# Altium schematic sheet Encoders.SchDoc
size A4; SheetNumber: 5; SheetTotal: 6
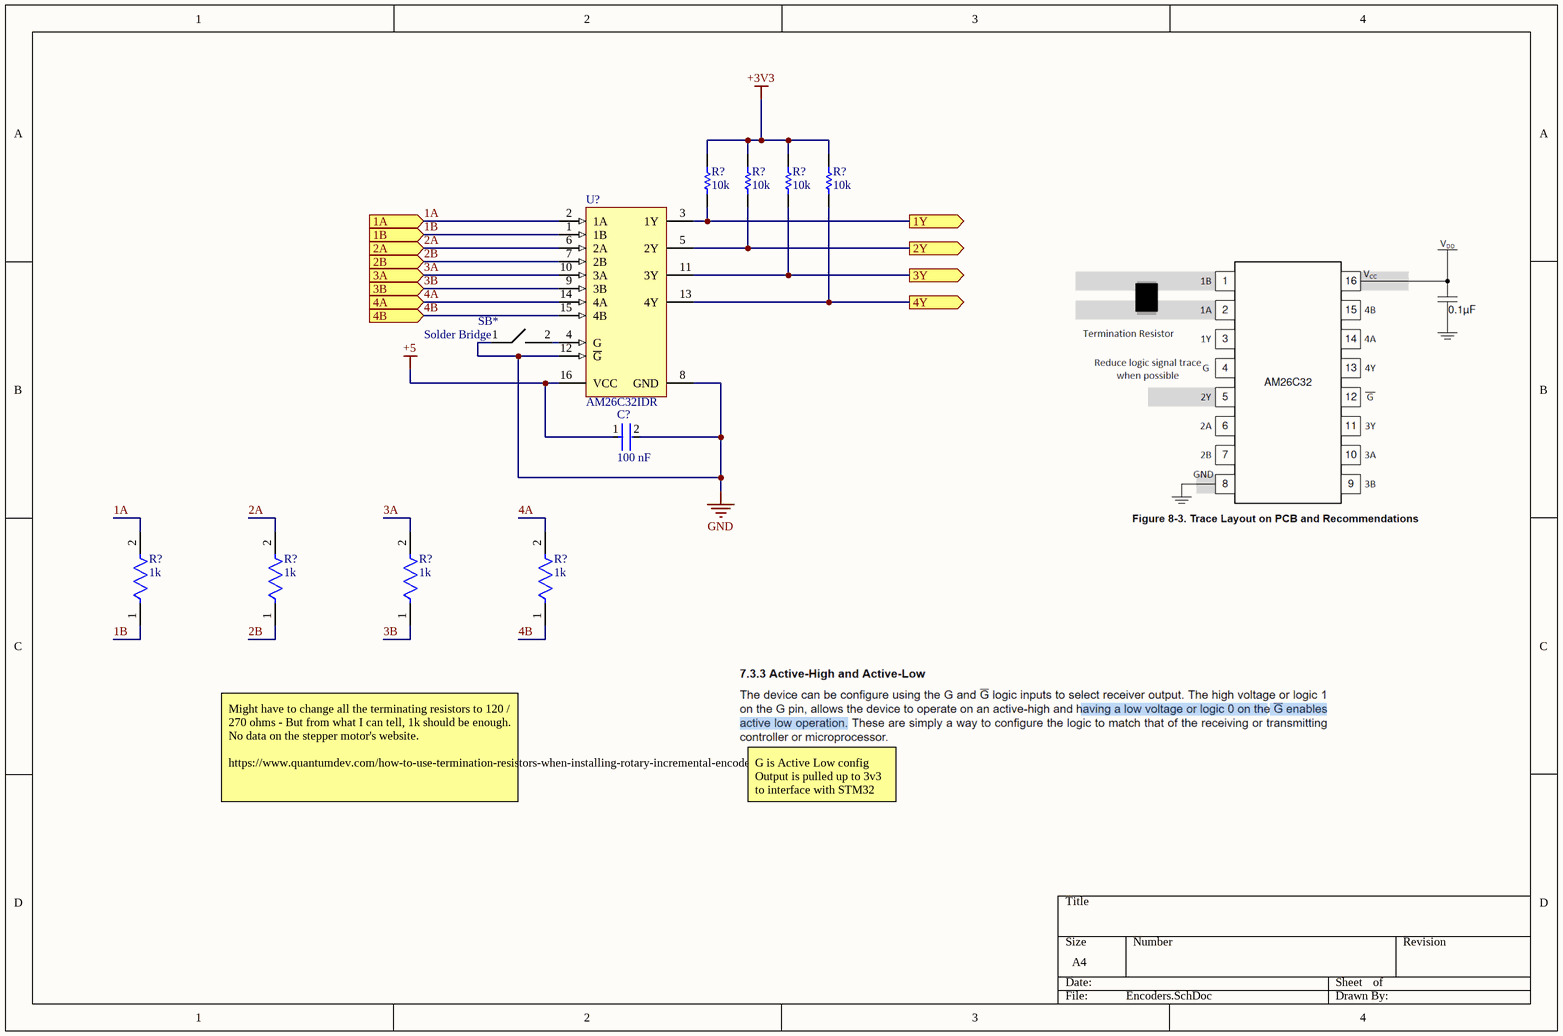
[diagram p0: Encoders.SchDoc]

## Parts
(Parts that share a designator on the sheet are numbered #1, #2 ... from top to bottom, then left to right.)
C?  Capacitance: 100 nF  [FP-CC0603-DA-MFG]  (hidden comment: CC0603KRX7R9BB104)
R?#1  Resistance: 10k  [RESC1609X50X30NL8T20]  (hidden comment: 0603WAF1002T5E)
R?#2  Resistance: 10k  [RESC1609X50X30NL8T20]  (hidden comment: 0603WAF1002T5E)
R?#3  Resistance: 10k  [RESC1609X50X30NL8T20]  (hidden comment: 0603WAF1002T5E)
R?#4  Resistance: 10k  [RESC1609X50X30NL8T20]  (hidden comment: 0603WAF1002T5E)
R?#5  1k  [FP-RC0603-0_55-IPC_C]
R?#6  1k  [FP-RC0603-0_55-IPC_C]
R?#7  1k  [FP-RC0603-0_55-IPC_C]
R?#8  1k  [FP-RC0603-0_55-IPC_C]
SB*  Solder Bridge  [Solder Bridge-Footprint-1]
U?  AM26C32IDR  [D0016A_L]

## Ports
1A (in), 1B (in), 1Y (out), 2A (in), 2B (in), 2Y (out), 3A (in), 3B (in), 3Y (out), 4A (in), 4B (in), 4Y (out)

## Nets
+3V3: R?#1.2 R?#2.2 R?#3.2 R?#4.2
+5: C?.1 U?.16(VCC)
GND: C?.2 SB*.1 U?.8(GND) U?.12(~{G})
1A: R?#5.2 U?.2(1A) ; port 1A
1B: R?#5.1 U?.1(1B) ; port 1B
1Y: R?#1.1 U?.3(1Y) ; port 1Y
2A: R?#6.2 U?.6(2A) ; port 2A
2B: R?#6.1 U?.7(2B) ; port 2B
2Y: R?#2.1 U?.5(2Y) ; port 2Y
3A: R?#7.2 U?.10(3A) ; port 3A
3B: R?#7.1 U?.9(3B) ; port 3B
3Y: R?#3.1 U?.11(3Y) ; port 3Y
4A: R?#8.2 U?.14(4A) ; port 4A
4B: R?#8.1 U?.15(4B) ; port 4B
4Y: R?#4.1 U?.13(4Y) ; port 4Y
NetSB*_2: SB*.2 U?.4(G)

## Notes on the sheet
- Might have to change all the terminating resistors to 120 / 270 ohms - But from what I can tell, 1k should be enough. No data on the stepper motor's website.
  https://www.quantumdev.com/how-to-use-termination-resistors-when-installing-rotary-incremental-encoders/
- G is Active Low config
  Output is pulled up to 3v3 to interface with STM32

## Library data of the parts
C? = CMP-2100-03601-2: CAP CER 0.1UF 50V X7R 0603; Manufacturer: YAGEO; Material: Ceramic; Temperature Coefficient: 15%; Tolerance: 0.1; Value: 100 nF; Height: 0.9mm; Voltage: 50 V; ComponentLink2Description: Datasheet; Device Class L2: Capacitors; Temperature Range High: +125°C; Category: Cap; Footprint Url: http://www.yageo.com/exep/pages/download/literatures/UPY-C_GEN_24.pdf; ComponentLink2URL: http://www.yageo.com/documents/recent/UPY-GPHC_X7R_6.3V-to-50V_18.pdf; Package: CC0603-DA; Temperature: -55°C to +125°C; Voltage Rating: 50 V; Temperature Characteristic: X7R; Device Class L1: Passive Components; Temperature Range Low: -55°C; Manufacturer Part Number: CC0603KRX7R9BB104; RoHS: TRUE; Automotive: No; Device Class L3: Ceramic Capacitors; Octopart: https://octopart.com/cc0603krx7r9bb104-yageo-42244635; Mouser Description: Multilayer Ceramic Capacitor, CC Series, 0.1 - F, - 10%, X7R, 50 V, 0603 [1608 Metric]; Lead Free: Yes; Digikey Description: CAP CER 0.1UF 50V X7R 0603
R?#1-R?#4 = CMP-1666-00005-4: 100mW Thick Film Resistors 75V ±100ppm/℃ ±1% 10kΩ 0603 Chip Resistor - Surface Mount ROHS; Max Operating Temperature: 155 degC; Voltage Rating: 75 V; PackageDescription: 2-Pin Surface Mount Device, Body 1.575 x 0.85 mm; ComponentLink1Description: Manufacturer URL; RoHSCompliant: true; PackageReference: 0603; REACH SVHC: Unknown; Length: 1.55 mm; Packaging: Tape and Reel; Min Operating Temperature: -55 degC; Mounting Technology: Surface Mount; ComponentLink2URL: https://datasheet.ciiva.com/11809/0900766b80d98afc-11809037.pdf; Height: 0.45 mm; ComponentLink2Description: Datasheet; Package Quantity: 5000; ComponentLink1URL: http://www.vishay.com/
R?#5-R?#8 = CMP-1659-00009-5: RC0603FR-071KL. RES 1K OHM 1% 1/10W 0603; Resistance: 1kR; Voltage Rating: 50V; Power Rating: 100mW; Temperature Coefficient: 100ppm/°C; Military Standard: Not; REACH SVHC: No SVHC; Size Code: 0603; Features: Moisture Resistant; Number of Terminations: 2; Technology: THICK FILM; Series: RC; Case Code (Metric): 1608; Resistance Tolerance: 1%; Resistor Type: Thick Film; Termination: SMD/SMT; Contact Plating: Tin; Radiation Hardening: No; Min Operating Temperature: -55°C; Max Operating Temperature: 155°C; Packaging: Tape and Reel; Max Power Dissipation: 100mW; RoHS Compliant: Yes; Height: 0.45mm; Lead Free: Lead Free; Case/Package: 0603; Length: 1.6mm; Tolerance: 1%; Case Code (Imperial): 0603; Construction: Rectangular; Depth: 0.8mm
SB* = CMP-00054-2: To bridge the connection duhh
U? = CMP-0310-00331-2: Quadruple Differential Line Receiver, 0 TX / 4 RX, 5V, -40 to 85 degC, 16-Pin SOIC (D), Green (RoHS & no Sb/Br); Manufacturer: Texas Instruments; ESD(kV): 2; SubFamily: RS-422; Rating: Catalog; Supply Voltage(s)(V): 5; ICC(Max)(mA): 15; Receivers Per Package: 4; Mounting Technology: Surface Mount; Eco-Plan: Green (RoHS & no Sb/Br); PackageDescription: 16-Pin Plastic Small Outline Integrated Circuit, 9.9 x 3.9 mm, Pitch 1.27 mm Pitch; ComponentLink2URL: http://www.ti.com/litv/pdf/mpds178g; ComponentLink2Description: Package Specification; Footprint: AM26LS32; PartNumber: AM26C32IDR; DatasheetVersion: SLLS104I; ComponentLink1URL: http://www.ti.com/general/docs/lit/getliterature.tsp?genericPartNumber=AM26C32&fileType=pdf; PackageVersion: revM, Jun-2011; # of TX/RX: 0 TX / 4 RX; ComponentLink1Description: Datasheet; Code_JEDEC: MS-012AC; PackageReference: D0016A